# EAGLE design M111 (EAGLE 6.6.0)
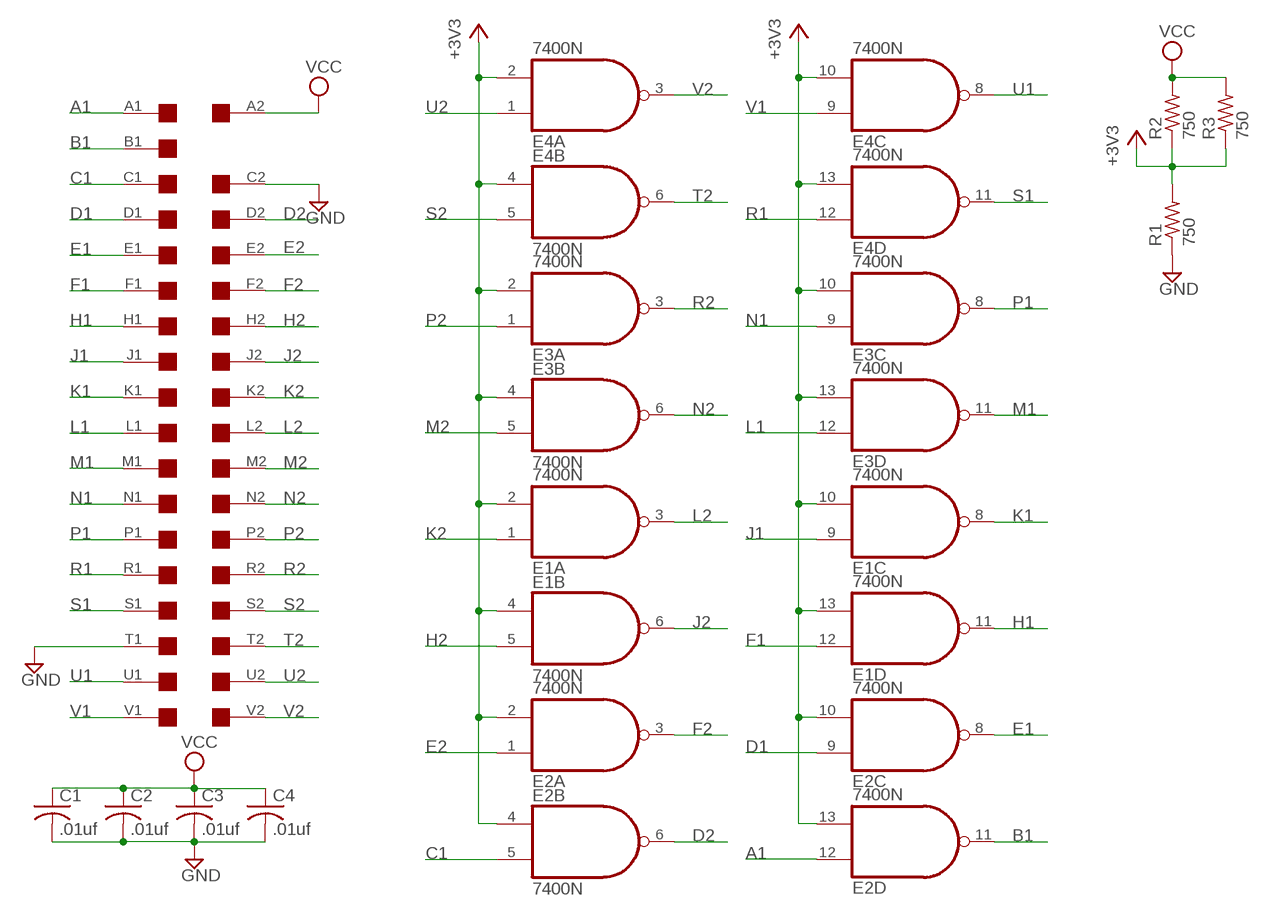
[diagram p0: schematic, sheet 1]

## Parts
A  EDGE-2CONNECTOR  [EDGE-CON2]
C1  .01uf  C-US050-025X075  [C050-025X075]
C2  .01uf  C-US050-025X075  [C050-025X075]
C3  .01uf  C-US050-025X075  [C050-025X075]
C4  .01uf  C-US050-025X075  [C050-025X075]
E1  7400N  [DIL14]
E2  7400N  [DIL14]
E3  7400N  [DIL14]
E4  7400N  [DIL14]
R1  750  R-US_0207/10  [0207/10]
R2  750  R-US_0207/10  [0207/10]
R3  750  R-US_0207/10  [0207/10]

## Nets
+3V3: E1.2(A:I1) E1.4(B:I0) E1.10(C:I1) E1.13(D:I1) E2.2(A:I1) E2.4(B:I0) E2.10(C:I1) E2.13(D:I1) E3.2(A:I1) E3.4(B:I0) E3.10(C:I1) E3.13(D:I1) E4.2(A:I1) E4.4(B:I0) E4.10(C:I1) E4.13(D:I1) R1.2 R2.1 R3.1
A1: A.A1 E2.12(D:I0)
B1: A.B1 E2.11(D:O)
C1: A.C1 E2.5(B:I1)
D1: A.D1 E2.9(C:I0)
D2: A.D2 E2.6(B:O)
E1: A.E1 E2.8(C:O)
E2: A.E2 E2.1(A:I0)
F1: A.F1 E1.12(D:I0)
F2: A.F2 E2.3(A:O)
GND: A.C2 A.T1 C1.2 C2.2 C3.2 C4.2 R1.1
H1: A.H1 E1.11(D:O)
H2: A.H2 E1.5(B:I1)
J1: A.J1 E1.9(C:I0)
J2: A.J2 E1.6(B:O)
K1: A.K1 E1.8(C:O)
K2: A.K2 E1.1(A:I0)
L1: A.L1 E3.12(D:I0)
L2: A.L2 E1.3(A:O)
M1: A.M1 E3.11(D:O)
M2: A.M2 E3.5(B:I1)
N1: A.N1 E3.9(C:I0)
N2: A.N2 E3.6(B:O)
P1: A.P1 E3.8(C:O)
P2: A.P2 E3.1(A:I0)
R1: A.R1 E4.12(D:I0)
R2: A.R2 E3.3(A:O)
S1: A.S1 E4.11(D:O)
S2: A.S2 E4.5(B:I1)
T2: A.T2 E4.6(B:O)
U1: A.U1 E4.8(C:O)
U2: A.U2 E4.1(A:I0)
V1: A.V1 E4.9(C:I0)
V2: A.V2 E4.3(A:O)
VCC: A.A2 C1.1 C2.1 C3.1 C4.1 R2.2 R3.2
Unconnected: A.B2

## Power pins joined to a net without a drawn wire
GND: E1.7(P:GND) E2.7(P:GND) E3.7(P:GND) E4.7(P:GND)
VCC: E1.14(P:VCC) E2.14(P:VCC) E3.14(P:VCC) E4.14(P:VCC)

## Library data of the parts
A = dec-con:EDGE-2: Double-Sided DEC edge connector.
C1-C4 = rcl:C-US: CAPACITOR, American symbol
E1-E4 = 74xx-us:74*00: Quad 2-input NAND gate
R1-R3 = rcl:R-US_: RESISTOR, American symbol

## Board
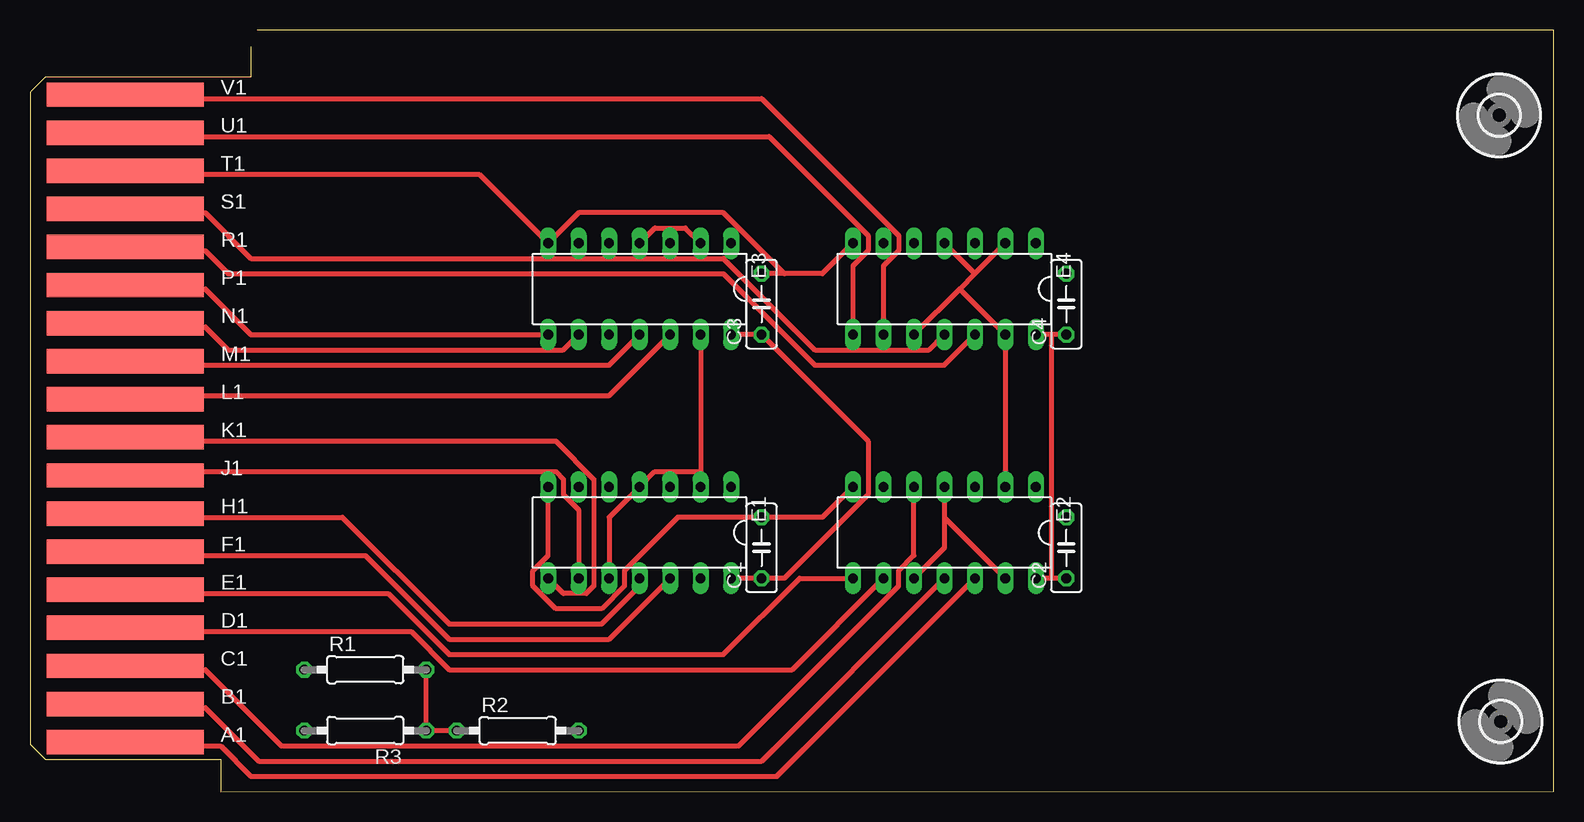
[diagram p1: board, top side]
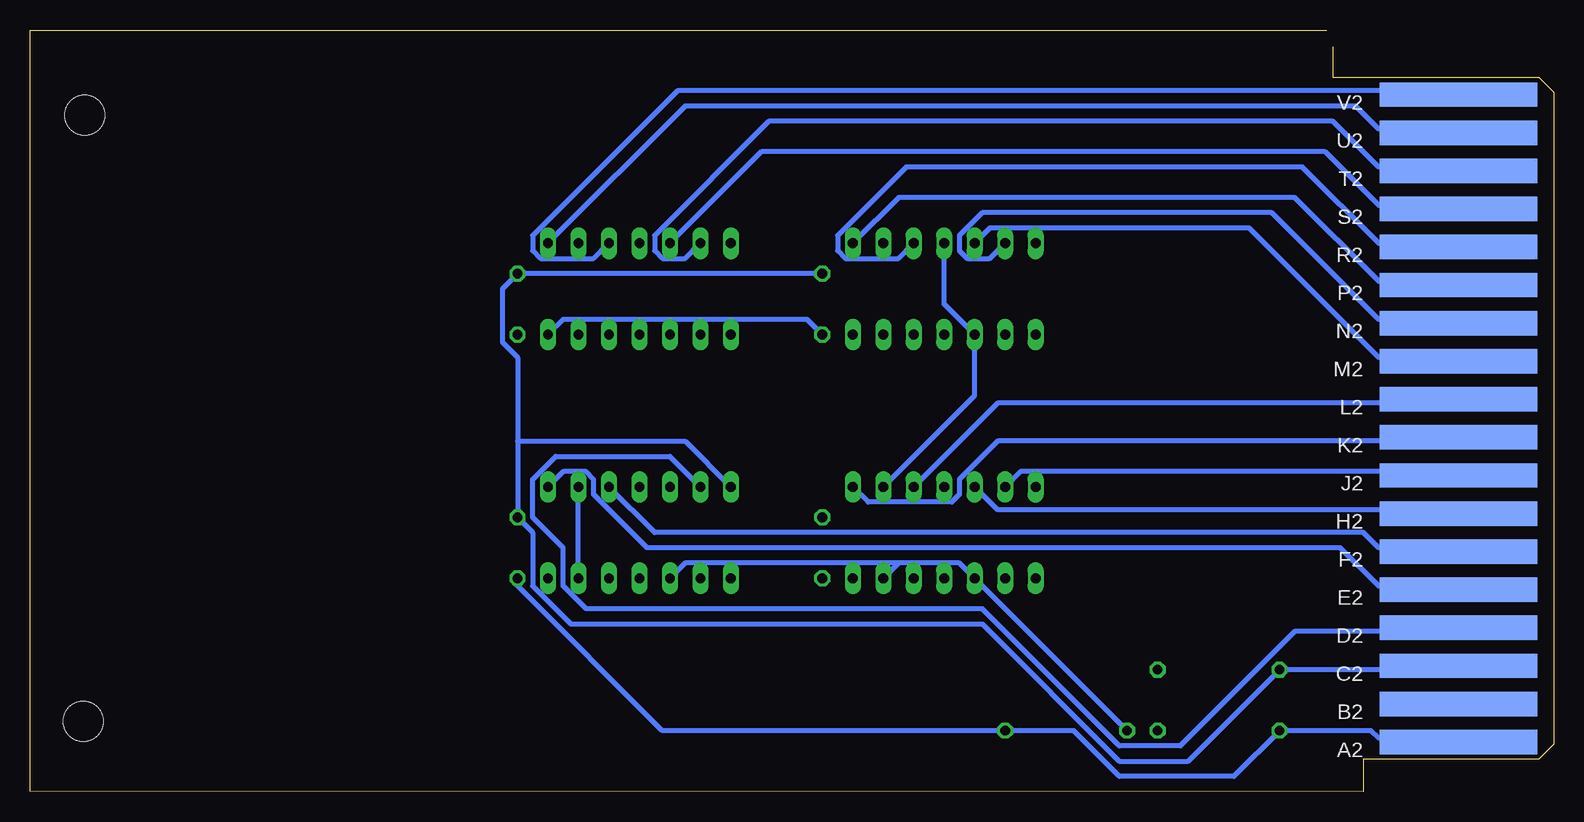
[diagram p2: board, bottom side, seen from below]

Size 126.98 x 63.5 mm. Coordinates in mm from the lower left corner, seen from the top.
Outline: 15.88,0 126.98,0.04 126.98,63.46 18.92,63.5
Copper layers (1+16): Top 0.035mm / dielectric 1.5mm / Bottom 0.035mm
Design rules "16mils": minimum track width 16mil, minimum drill 32mil, track to track 15mil, track to pad 10mil, pad to pad 10mil, via to via 10mil, smd to smd 10mil, copper to edge 13mil, drill to drill 10mil, minimum pad ring 10mil, minimum via ring 8mil, stop-mask expansion 0mil, vias tented up to drill 0mil, thermal gap 10mil

### Footprints (pad centres in the part's own frame; a part is rotated, then mirrored left to right if it is on the bottom)
EDGE-CON2 = smd 13.106 x 2.032: A1 7.938,4.128; B1 7.938,7.303; C1 7.938,10.477; D1 7.938,13.652; E1 7.938,16.828; F1 7.938,20.003; H1 7.938,23.177; J1 7.938,26.352; K1 7.938,29.527; L1 7.938,32.703; M1 7.938,35.877; N1 7.938,39.053; P1 7.938,42.227; R1 7.938,45.403; S1 7.938,48.578; T1 7.938,51.752; U1 7.938,54.928; V1 7.938,58.102 | smd 13.106 x 2.032 bottom: A2 7.938,4.128; B2 7.938,7.303; C2 7.938,10.477; D2 7.938,13.652; E2 7.938,16.828; F2 7.938,20.003; H2 7.938,23.177; J2 7.938,26.352; K2 7.938,29.527; L2 7.938,32.703; M2 7.938,35.877; N2 7.938,39.053; P2 7.938,42.227; R2 7.938,45.403; S2 7.938,48.578; T2 7.938,51.752; U2 7.938,54.928; V2 7.938,58.102
C050-025X075 = drill 0.813 octagon: 1 -2.54,0; 2 2.54,0
DIL14 = drill 0.813 long: 1 -7.62,-3.81; 2 -5.08,-3.81; 3 -2.54,-3.81; 4 0,-3.81; 5 2.54,-3.81; 6 5.08,-3.81; 7 7.62,-3.81; 8 7.62,3.81; 9 5.08,3.81; 10 2.54,3.81; 11 0,3.81; 12 -2.54,3.81; 13 -5.08,3.81; 14 -7.62,3.81
0207/10 = drill 0.813 octagon: 1 -5.08,0; 2 5.08,0
3,3 = hole 3.3: 0,0

### Placement (x,y rotation side)
A  0,0 0 top
C1  60.96,20.32 90 top
C2  86.36,20.32 90 top
C3  60.96,40.64 90 top
C4  86.36,40.64 90 top
E1  50.8,21.59 180 top
E2  76.2,21.59 180 top
E3  50.8,41.91 180 top
E4  76.2,41.91 180 top
R1  27.94,10.16 0 top
R2  40.64,5.08 0 top
R3  27.94,5.08 180 top
U$2  [3,3]  122.43,56.39 0 top
U$3  [3,3]  122.56,5.84 0 top

### Tracks (layer width: path | path; a pad name or v marks a point on that pad's centre or on a via)
+3V3
  Top 0.406: E2.10 76.2,20.32 76.2,22.86 | E2.4 76.2,22.86 | 76.2,22.86 E2.13 | E4.2 78.74,43.18 | 78.74,43.18 77.47,41.91 | 77.47,41.91 E4.10 | 78.74,43.18 E4.4 | 77.47,41.91 E4.13 E2.2 | E3.13 55.88,26.67 | 55.88,26.67 E1.2 | E3.2 54.61,46.99 52.07,46.99 E3.4 | R2.1 R3.1 R1.2 | E1.10 48.26,22.86 E1.4 52.07,26.67 55.88,26.67
  Bottom 0.406: E2.13 E2.2 | E1.2 48.26,33.02 E3.10 50.8,40.64 E3.4 | 54.61,19.05 E1.13 | 54.61,19.05 49.53,19.05 E1.10 R2.1 | E2.10 72.39,19.05 54.61,19.05
A1
  Top 0.406: E2.12 62.23,1.27 18.41,1.27 15.88,3.81 8.26,3.81 A.A1
B1
  Top 0.406: E2.11 60.96,2.54 19.05,2.54 14.61,6.99 8.26,6.99 A.B1
C1
  Top 0.406: E2.5 73.66,19.68 72.39,18.41 72.39,17.14 59.05,3.81 20.95,3.81 14.61,10.16 8.26,10.16 A.C1
D1
  Top 0.406: E2.9 63.5,10.16 34.92,10.16 31.75,13.34 8.26,13.34 A.D1
D2
  Bottom 0.406: E2.6 73.66,27.94 83.19,27.94 85.09,26.04 85.09,22.86 82.55,20.32 82.55,17.14 80.64,15.24 47.62,15.24 36.2,3.81 31.11,3.81 21.59,13.34 8.26,13.34 A.D2
E1
  Top 0.406: E2.8 64.14,17.78 57.78,11.43 34.92,11.43 29.84,16.51 8.26,16.51 A.E1
E2
  Bottom 0.406: E2.1 82.55,26.67 80.64,26.67 80.01,26.04 80.01,24.77 75.56,20.32 17.78,20.32 14.61,17.14 8.26,17.14 A.E2
F1
  Top 0.406: E1.12 48.26,12.7 34.92,12.7 27.94,19.68 8.26,19.68 A.F1
F2
  Bottom 0.406: E2.3 74.93,21.59 15.88,21.59 14.61,20.32 8.26,20.32 A.F2
GND
  Top 0.406: E2.7 66.04,22.86 C1.2 53.98,22.86 49.53,18.41 49.53,17.14 47.62,15.24 43.81,15.24 41.91,17.14 41.91,18.41 43.18,19.68 E1.7 | 62.87,43.18 66.04,43.18 E4.7 | 62.87,43.18 C3.2 | 62.87,43.18 57.78,48.26 45.72,48.26 E3.7 37.47,51.44 8.26,51.44 A.T1
  Bottom 0.406: A.C2 8.26,10.16 R1.1 30.48,2.54 36.2,2.54 47.62,13.97 81.92,13.97 85.09,17.14 85.09,21.59 C2.2 86.36,29.21 | 86.36,29.21 86.36,36.2 87.63,37.47 87.63,41.91 C4.2 C3.2 | E2.7 72.39,29.21 86.36,29.21
H1
  Top 0.406: E1.11 50.8,17.14 47.62,13.97 34.92,13.97 26.04,22.86 8.26,22.86 A.H1
H2
  Bottom 0.406: E1.5 46.35,23.5 8.26,23.5 A.H2
J1
  Top 0.406: E1.9 45.72,23.5 44.45,24.77 44.45,26.04 43.81,26.67 8.26,26.67 A.J1
J2
  Bottom 0.406: E1.6 44.45,26.67 8.26,26.67 A.J2
K1
  Top 0.406: E1.8 44.45,16.51 46.35,16.51 46.99,17.14 46.99,26.04 43.81,29.21 8.26,29.21 A.K1
K2
  Bottom 0.406: E1.1 57.15,24.13 50.16,24.13 49.53,24.77 49.53,26.04 46.35,29.21 8.26,29.21 A.K2
L1
  Top 0.406: E3.12 48.26,33.02 8.26,33.02 A.L1
L2
  Bottom 0.406: E1.3 46.35,32.38 8.26,32.38 A.L2
M1
  Top 0.406: E3.11 48.26,35.56 8.26,35.56 A.M1
M2
  Bottom 0.406: E3.5 46.99,46.99 25.4,46.99 14.61,36.2 8.26,36.2 A.M2
N1
  Top 0.406: E3.9 44.45,36.83 16.51,36.83 14.61,38.73 8.26,38.73 A.N1
N2
  Bottom 0.406: E3.6 46.99,44.45 48.9,44.45 49.53,45.09 49.53,46.35 47.62,48.26 23.5,48.26 14.61,39.37 8.26,39.37 A.N2
P1
  Top 0.406: E3.8 18.41,38.1 14.61,41.91 8.26,41.91 A.P1
P2
  Bottom 0.406: E3.1 54.61,49.53 21.59,49.53 14.61,42.55 8.26,42.55 A.P2
R1
  Top 0.406: E4.12 76.2,35.56 65.41,35.56 57.78,43.18 16.51,43.18 14.61,45.09 8.26,45.09 A.R1
R2
  Bottom 0.406: E3.3 54.61,44.45 59.05,44.45 59.69,45.09 59.69,46.35 53.98,52.07 20.95,52.07 14.61,45.72 8.26,45.72 A.R2
S1
  Top 0.406: E4.11 74.93,36.83 65.41,36.83 57.78,44.45 18.41,44.45 14.61,48.26 8.26,48.26 A.S1
S2
  Bottom 0.406: E4.5 66.04,53.34 19.05,53.34 14.61,48.9 8.26,48.9 A.S2
T2
  Bottom 0.406: E4.6 72.39,44.45 74.3,44.45 74.93,45.09 74.93,46.35 65.41,55.88 18.41,55.88 14.61,52.07 8.26,52.07 A.T2
U1
  Top 0.406: E4.8 68.58,43.81 69.85,45.09 69.85,46.35 61.59,54.61 8.26,54.61 A.U1
U2
  Bottom 0.406: E4.1 72.39,57.15 16.51,57.15 14.61,55.24 8.26,55.24 A.U2
V1
  Top 0.406: E4.9 71.12,43.81 72.39,45.09 72.39,46.35 60.96,57.78 8.26,57.78 A.V1
V2
  Bottom 0.406: E4.3 80.01,44.45 84.45,44.45 85.09,45.09 85.09,46.35 73.03,58.42 8.26,58.42 A.V2
VCC
  Top 0.406: C2.1 85.09,17.78 | 85.09,17.78 E2.14 | C4.1 85.09,38.1 | 85.09,38.1 E4.14 | 85.09,38.1 85.09,17.78 | E1.14 C1.1 62.87,17.78 69.85,24.77 69.85,29.21 C3.1 E3.14
  Bottom 0.406: E4.14 82.55,39.37 62.23,39.37 C3.1 | A.A2 8.26,4.45 14.61,4.45 15.24,5.08 R3.2 26.67,1.27 36.2,1.27 40.01,5.08 R2.2 74.3,5.08 86.36,17.14 C2.1